# EAGLE design shiftRegister (EAGLE 9.2.0)
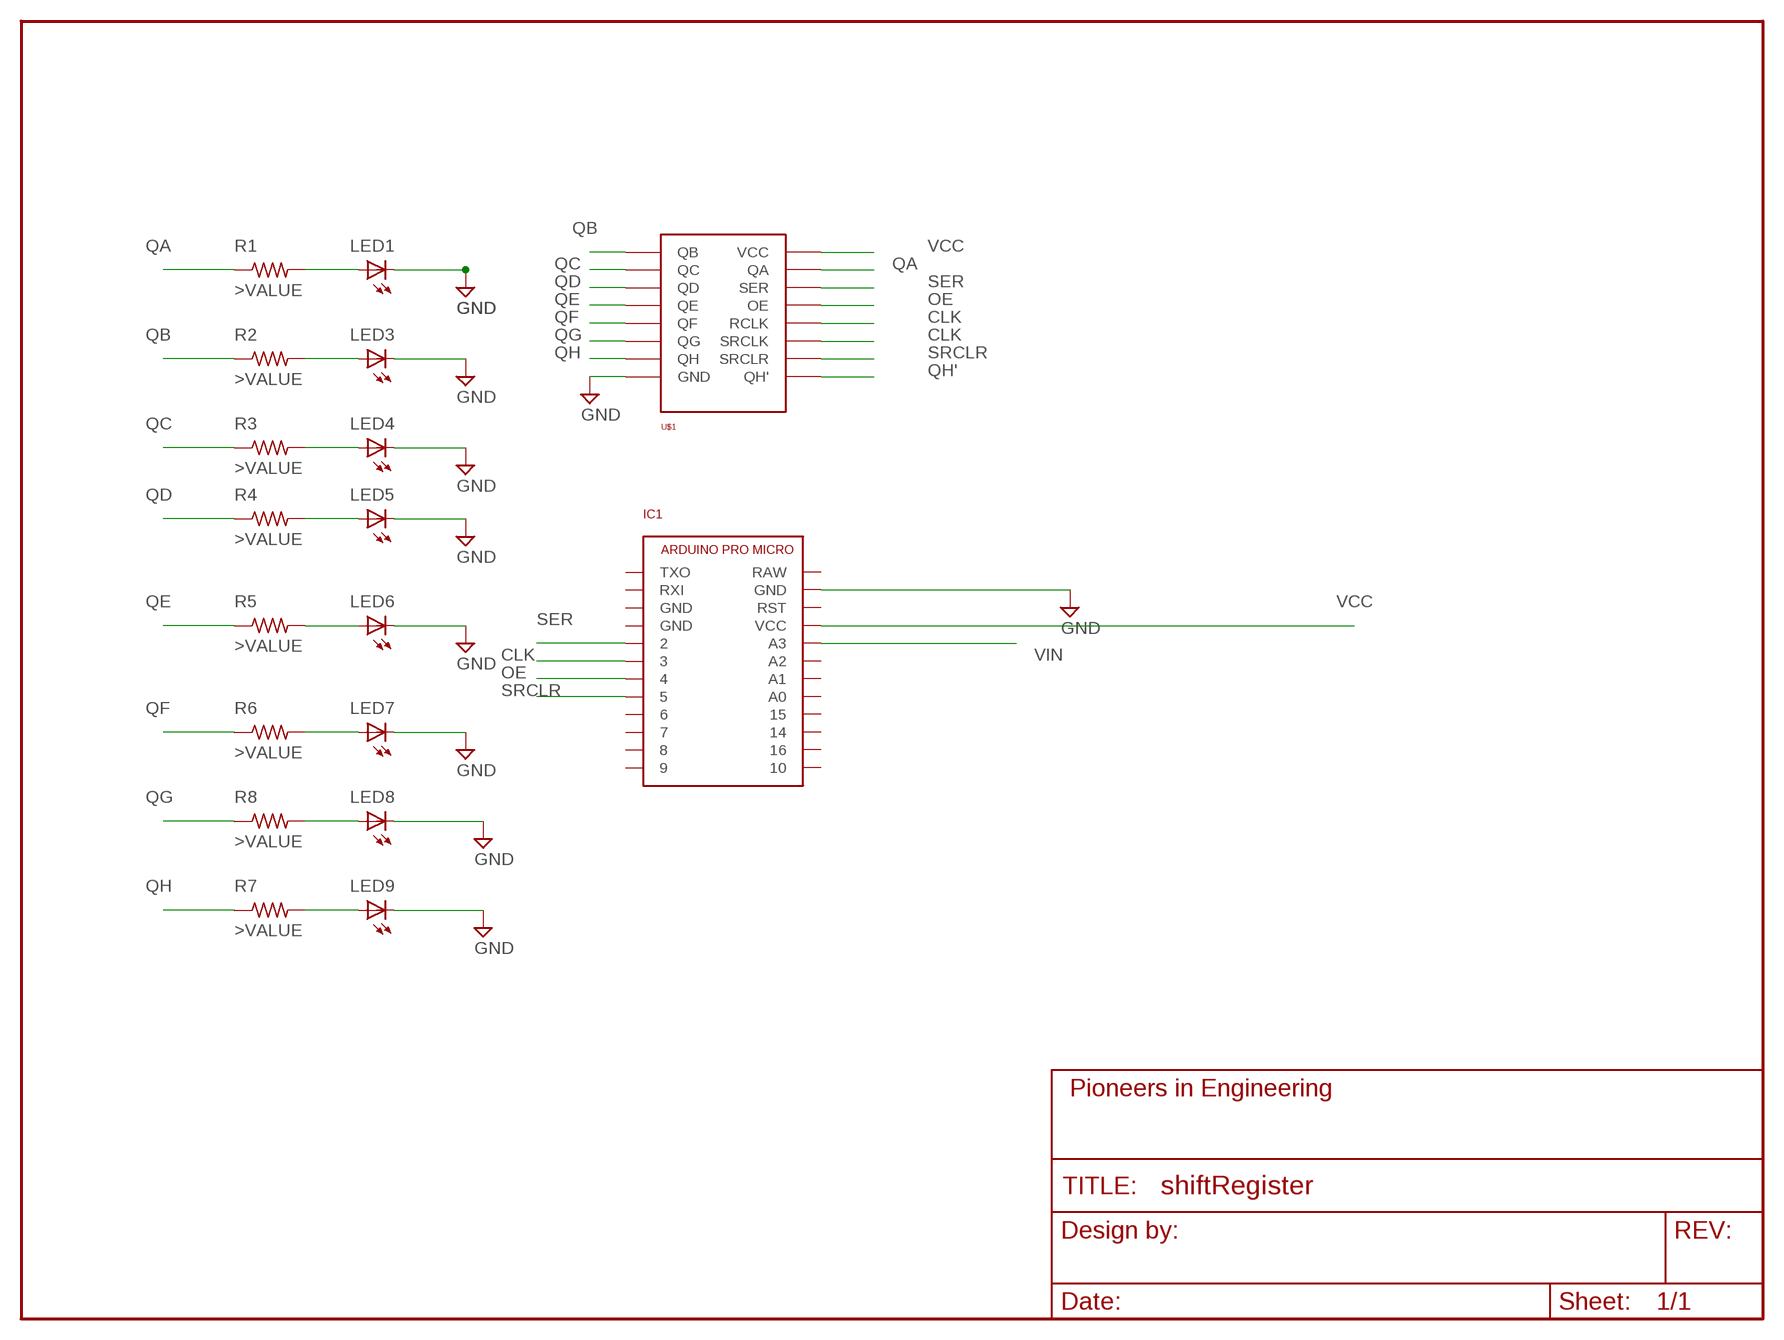
[diagram p0: schematic, sheet 1]

## Parts
IC1  ARDUINO_PRO_MICRO  [ARDUINO_PRO_MICRO]
LED1  LED-FKIT-1206  [FKIT-LED-1206]
LED3  LED-FKIT-1206  [FKIT-LED-1206]
LED4  LED-FKIT-1206  [FKIT-LED-1206]
LED5  LED-FKIT-1206  [FKIT-LED-1206]
LED6  LED-FKIT-1206  [FKIT-LED-1206]
LED7  LED-FKIT-1206  [FKIT-LED-1206]
LED8  LED-FKIT-1206  [FKIT-LED-1206]
LED9  LED-FKIT-1206  [FKIT-LED-1206]
R1  >VALUE  R-US_R0603  [R0603]
R2  >VALUE  R-US_R0603  [R0603]
R3  >VALUE  R-US_R0603  [R0603]
R4  >VALUE  R-US_R0603  [R0603]
R5  >VALUE  R-US_R0603  [R0603]
R6  >VALUE  R-US_R0603  [R0603]
R7  >VALUE  R-US_R0603  [R0603]
R8  >VALUE  R-US_R0603  [R0603]
U$1  SN74HC595  [SN74HC595]

## Nets
CLK: IC1.3 U$1.RCLK U$1.SRCLK
GND: IC1.GND@2(GND) LED1.C LED3.C LED4.C LED5.C LED6.C LED7.C LED8.C LED9.C U$1.GND
N$1: LED1.A R1.2
N$2: LED3.A R2.2
N$3: LED4.A R3.2
N$4: LED5.A R4.2
N$5: LED6.A R5.2
N$6: LED7.A R6.2
N$7: LED8.A R8.2
N$8: LED9.A R7.2
OE: IC1.4 U$1.OE
QA: R1.1 U$1.QA
QB: R2.1 U$1.QB
QC: R3.1 U$1.QC
QD: R4.1 U$1.QD
QE: R5.1 U$1.QE
QF: R6.1 U$1.QF
QG: R8.1 U$1.QG
QH: R7.1 U$1.QH
QH': U$1.QH'
SER: IC1.2 U$1.SER
SRCLR: IC1.5 U$1.SRCLR
VCC: IC1.VCC U$1.VCC
VIN: IC1.A3
Unconnected: IC1.6 IC1.7 IC1.8 IC1.9 IC1.10 IC1.14 IC1.15 IC1.16 IC1.A0 IC1.A1 IC1.A2 IC1.GND@0(GND) IC1.GND@1(GND) IC1.RAW IC1.RST IC1.RXI IC1.TXO

## Library data of the parts
IC1 = pie:ARDUINO_PRO_MICRO: Arduino Pro Micro Electrical System Year 9's Smart Sensor Core Pin Outs <https://cdn.sparkfun.com/assets/9/c/3/c/4/523a1765757b7f5c6e8b4567.png> Buy Here <http://www.aliexpress.com/item/Mini-Leonardo-Pro-Micro-ATmega32U4-5V-16MHz-Module-For-Arduino-Best-Quality/32284746884.html?ws_ab_test=searchweb201556_8,searchweb201602_2_10057_10056_10065_10055_10054_10067_10069_10059_10058_10017_10070_10060_10061_10052_10062_10053_10050_10051,searchweb201603_1&btsid=45993952-29ca-4de4-a0fb-c7fb72b8e1a5> Thru Hole Female Pins <http://www.digikey.com/product-search/en?keywords=929974E-01-12-ND> Surface Mount Female Pins <http://www.digikey.com/product-detail/en/sullins-connector-solutions/NPTC121KFXC-RC/S5604-ND/776062>; DESCRIPTION: Arduino Pro Micro; DISTRIBUTOR: AliExpress; DISTRIBUTOR_PART_NUMBER: 32284746884; MANUFACTURER: Feiyang electronics; NOTES: https://www.aliexpress.com/item/Mini-Leonardo-Pro-Micro-ATmega32U4-5V-16MHz-Module-For-Arduino-Best-Quality/32284746884.html?ws_ab_test=searchweb201556_8,searchweb201602_2_10057_10056_10065_10055_10054_10067_10069_10059_10058_10017_10070_10060_10061_10052_10062_10053_10050_10051,searchweb201603_1&btsid=45993952-29ca-4de4-a0fb-c7fb72b8e1a5; PACKAGE: ARDUINO_PRO_MICRO; REFERENCE_DEST: ARDUINO_PRO_MICRO
LED1 LED3-LED9 = pie:LED: LEDs Standard schematic elements and footprints for 5mm, 3mm, 1206, and 0603 sized LEDs. 5mm - Spark Fun Electronics SKU : COM-00529 (and others); PIE-INT-REF-NUM: LED
R1-R8 = pie:R-US_: RESISTOR, American symbol; DESCRIPTION: RESISTOR, American symbol; DISTRIBUTOR: DigiKey; MANUFACTURER: Rohm Semiconductor; NOTES: Cut Tape; PACKAGE: R0603
U$1 = pie:SN74HC595

## Board
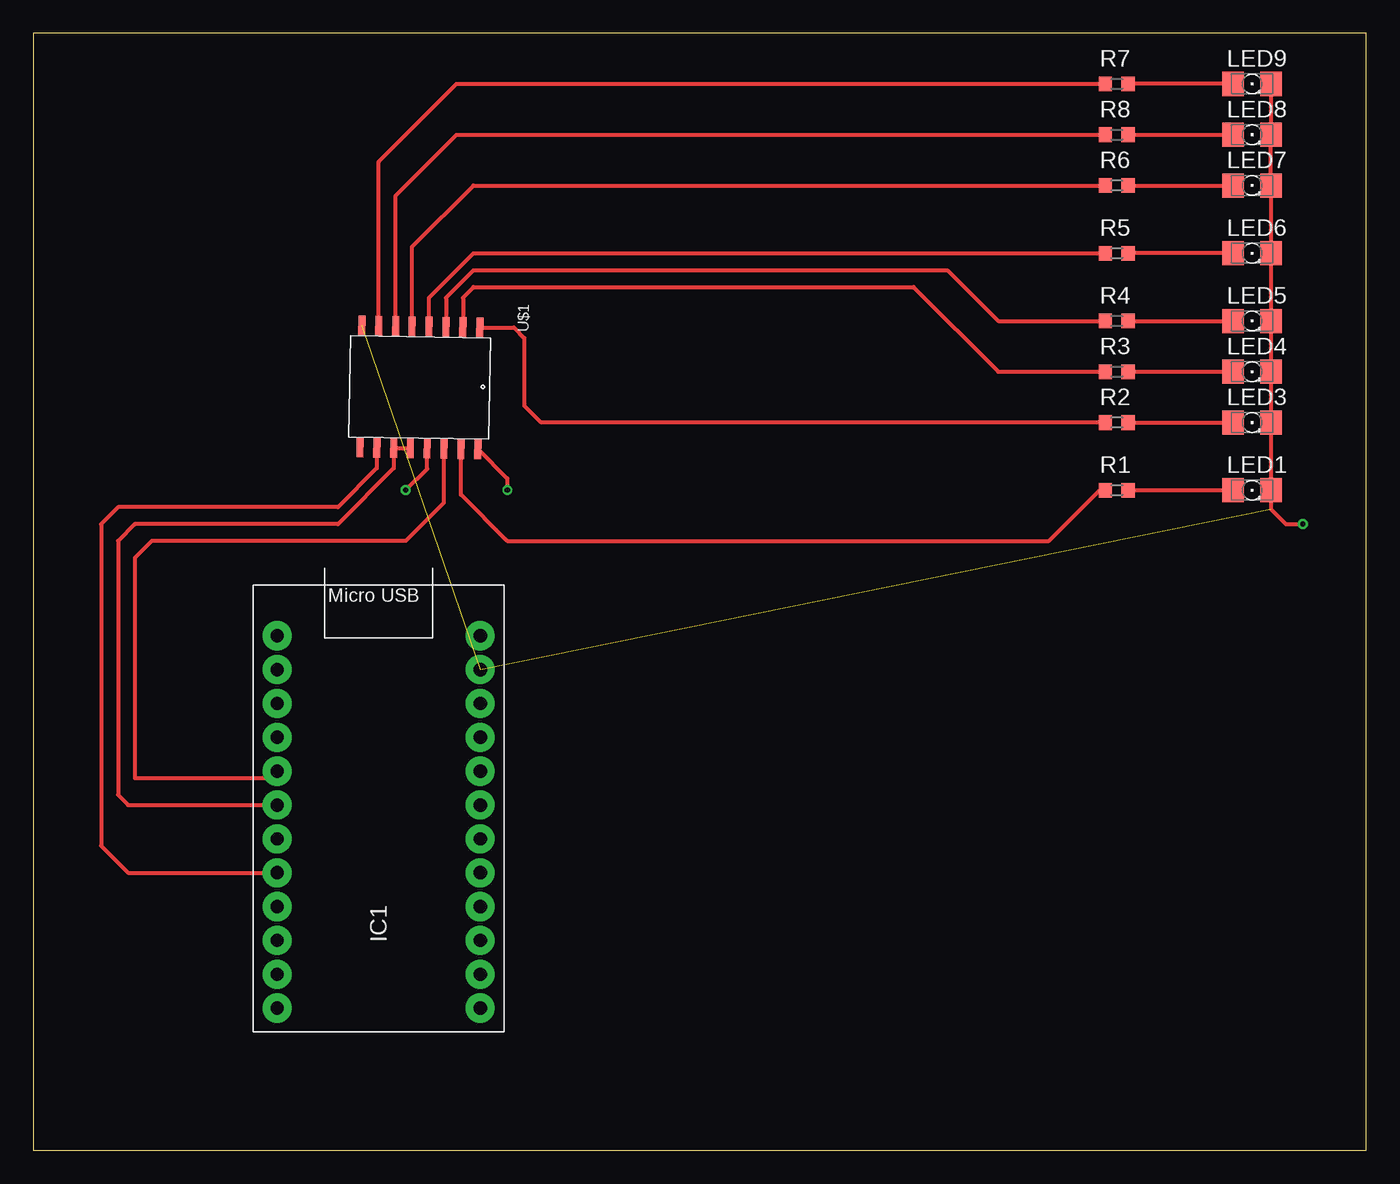
[diagram p1: board, top side]
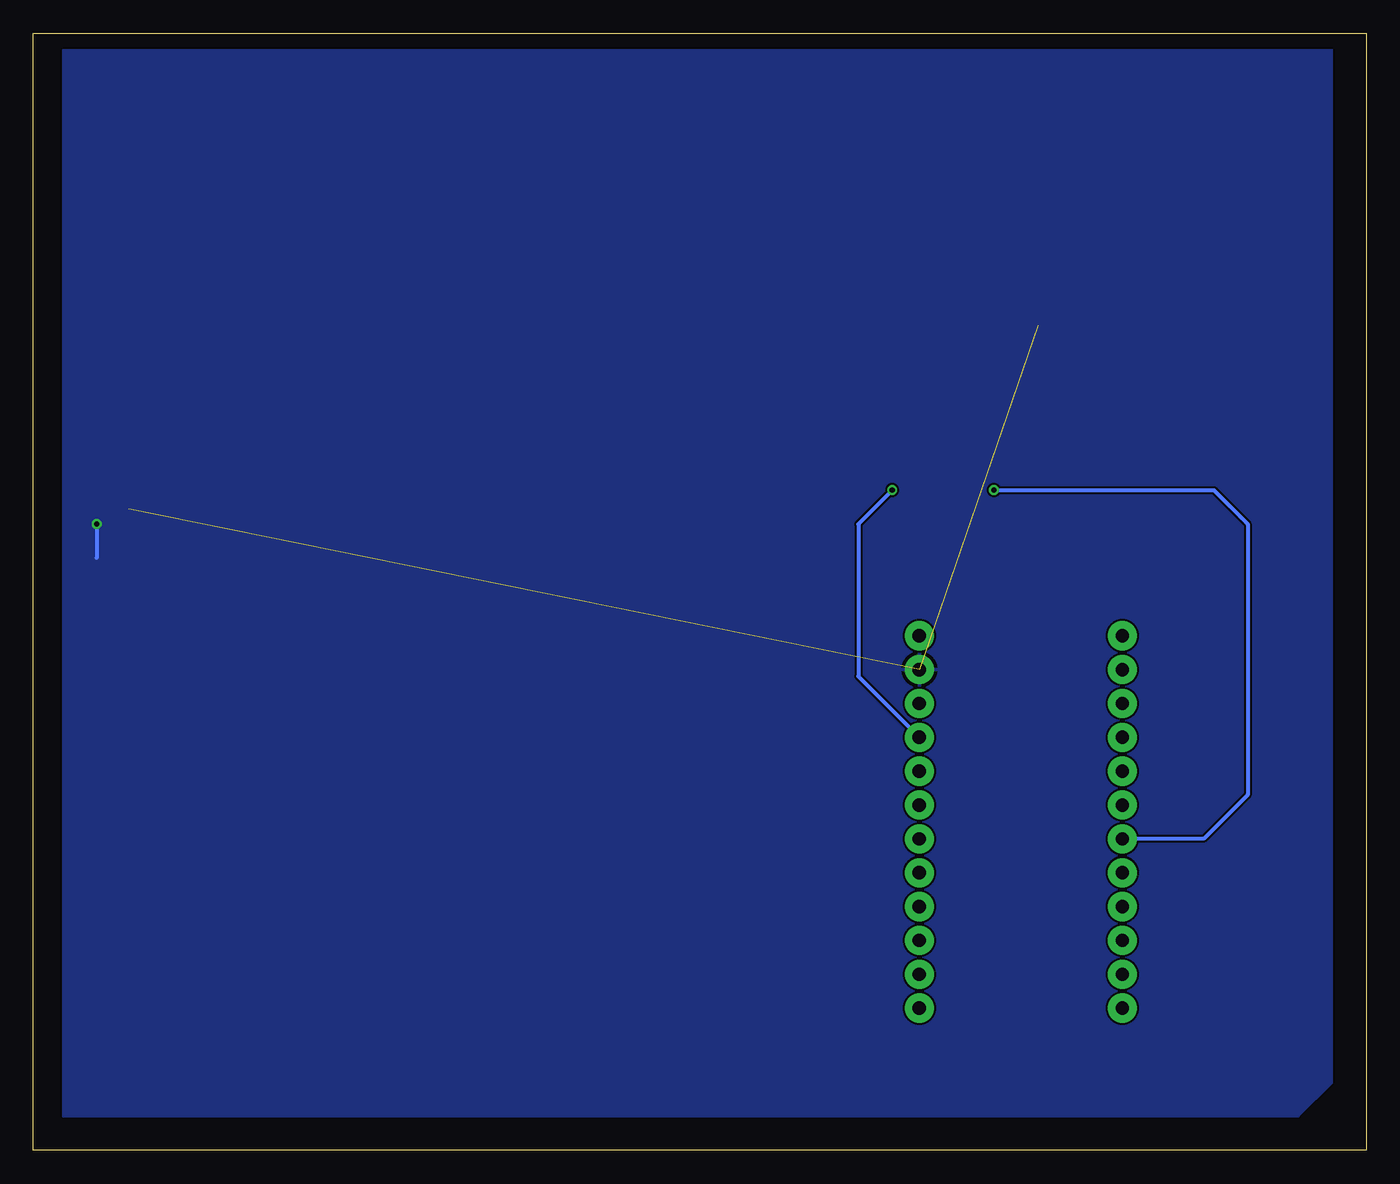
[diagram p2: board, bottom side, seen from below]

Size 100 x 83.81 mm. Coordinates in mm from the lower left corner, seen from the top.
Outline: 0,0 100,0 100,83.81 0,83.81 0,0
Copper layers (1*16): Top 2mil / dielectric 9mil / Bottom 2mil
Design rules "pie": minimum track width 6mil, minimum drill 15mil, track to track 6mil, track to pad 6mil, pad to pad 6mil, via to via 6mil, smd to smd 6mil, copper to edge 25mil, drill to drill 7mil, minimum pad ring 7mil, minimum via ring 7mil, stop-mask expansion 3mil, vias tented up to drill 21mil, thermal gap 10mil

### Footprints (pad centres in the part's own frame; a part is rotated, then mirrored left to right if it is on the bottom)
ARDUINO_PRO_MICRO = drill 1 pad 2.184: 2 1.778,19.558; 3 1.778,17.018; 4 1.778,14.478; 5 1.778,11.938; 6 1.778,9.398; 7 1.778,6.858; 8 1.778,4.318; 9 1.778,1.778; 10 17.018,1.778; 14 17.018,6.858; 15 17.018,9.398; 16 17.018,4.318; A0 17.018,11.938; A1 17.018,14.478; A2 17.018,17.018; A3 17.018,19.558; GND@0 1.778,24.638; GND@1 1.778,22.098; GND@2 17.018,27.178; RAW 17.018,29.718; RST 17.018,24.638; RXI 1.778,27.178; TXO 1.778,29.718; VCC 17.018,22.098
FKIT-LED-1206 = smd 1.6 x 1.803: A -1.422,0; C 1.422,0
R0603 = smd 1 x 1.1: 1 -0.85,0; 2 0.85,0
SN74HC595 = smd 0.51 x 1.515: GND 9.655,-0.757; OE 4.615,8.357; QA 2.075,8.357; QB 0.805,-0.757; QC 2.075,-0.757; QD 3.345,-0.757; QE 4.615,-0.757; QF 5.885,-0.757; QG 7.115,-0.757; QH 8.385,-0.757; QH' 9.655,8.357; RCLK 5.885,8.357; SER 3.345,8.357; SRCLK 7.115,8.357; SRCLR 8.385,8.357; VCC 0.805,8.357

### Placement (x,y rotation side)
IC1  16.51,8.89 0 top
LED1  91.44,49.53 0 top
LED3  91.44,54.61 0 top
LED4  91.44,58.42 0 top
LED5  91.44,62.23 0 top
LED6  91.44,67.31 0 top
LED7  91.44,72.39 0 top
LED8  91.44,76.2 0 top
LED9  91.44,80.01 0 top
R1  81.28,49.53 0 top
R2  81.28,54.61 0 top
R3  81.28,58.42 0 top
R4  81.28,62.23 0 top
R5  81.28,67.31 0 top
R6  81.28,72.39 0 top
R7  81.28,80.01 0 top
R8  81.28,76.2 0 top
U$1  34.29,60.96 179.1 top

### Tracks (layer width: path | path; a pad name or v marks a point on that pad's centre or on a via)
CLK
  Top 0.305: IC1.3 7.11,25.91 6.35,26.67 6.35,45.72 7.62,46.99 22.86,46.99 27.05,51.18 U$1.SRCLK 27.06,52.7 U$1.RCLK
GND  (via drill 0.38)  (2 unrouted)
  Top 0.305: LED9.C LED8.C LED7.C LED6.C LED5.C LED4.C LED3.C LED1.C 92.86,48.11 93.98,46.99 v95.25,46.99
  Bottom 0.305: v95.25,46.99 95.25,44.45
  pour Bottom: 2.54,82.55 97.79,82.55 97.79,2.54 5.08,2.54 2.54,5.08
N$1
  Top 0.305: R1.2 LED1.A
N$2
  Top 0.305: R2.2 LED3.A
N$3
  Top 0.305: R3.2 LED4.A
N$4
  Top 0.305: R4.2 LED5.A
N$5
  Top 0.305: LED6.A R5.2
N$6
  Top 0.305: R6.2 LED7.A
N$7
  Top 0.305: R8.2 LED8.A
N$8
  Top 0.305: LED9.A R7.2
OE  (via drill 0.38)
  Top 0.305: v27.94,49.53 29.54,51.13 U$1.OE
  Bottom 0.305: v27.94,49.53 11.43,49.53 8.89,46.99 8.89,26.67 12.19,23.37 IC1.4
QA
  Top 0.305: R1.1 80.01,49.53 76.2,45.72 35.56,45.72 32.08,49.2 U$1.QA
QB
  Top 0.305: U$1.QB 36.06,61.73 36.83,60.96 36.83,55.88 38.1,54.61 R2.1
QC
  Top 0.305: R3.1 72.39,58.42 66.04,64.77 33.02,64.77 32.23,63.98 U$1.QC
QD
  Top 0.305: R4.1 72.39,62.23 68.58,66.04 33.02,66.04 30.96,63.98 U$1.QD
QE
  Top 0.305: U$1.QE 29.69,63.98 33.02,67.31 R5.1
QF
  Top 0.305: U$1.QF 28.42,67.79 33.02,72.39 R6.1
QG
  Top 0.305: U$1.QG 27.19,71.64 31.75,76.2 R8.1
QH
  Top 0.305: U$1.QH 25.92,74.18 31.75,80.01 R7.1
SER
  Top 0.305: IC1.2 17.78,27.94 7.62,27.94 7.62,44.45 8.89,45.72 27.94,45.72 30.48,48.26 30.81,48.59 U$1.SER
SRCLR
  Top 0.305: IC1.5 7.11,20.83 5.08,22.86 5.08,46.99 6.35,48.26 22.86,48.26 25.77,51.18 U$1.SRCLR
VCC  (via drill 0.38)
  Top 0.305: U$1.VCC 35.56,50.41 v35.56,49.53
  Bottom 0.305: v35.56,49.53 38.1,46.99 38.1,35.56 IC1.VCC